# EAGLE design FTDIBreakoutAdapter (EAGLE 7.7.0)
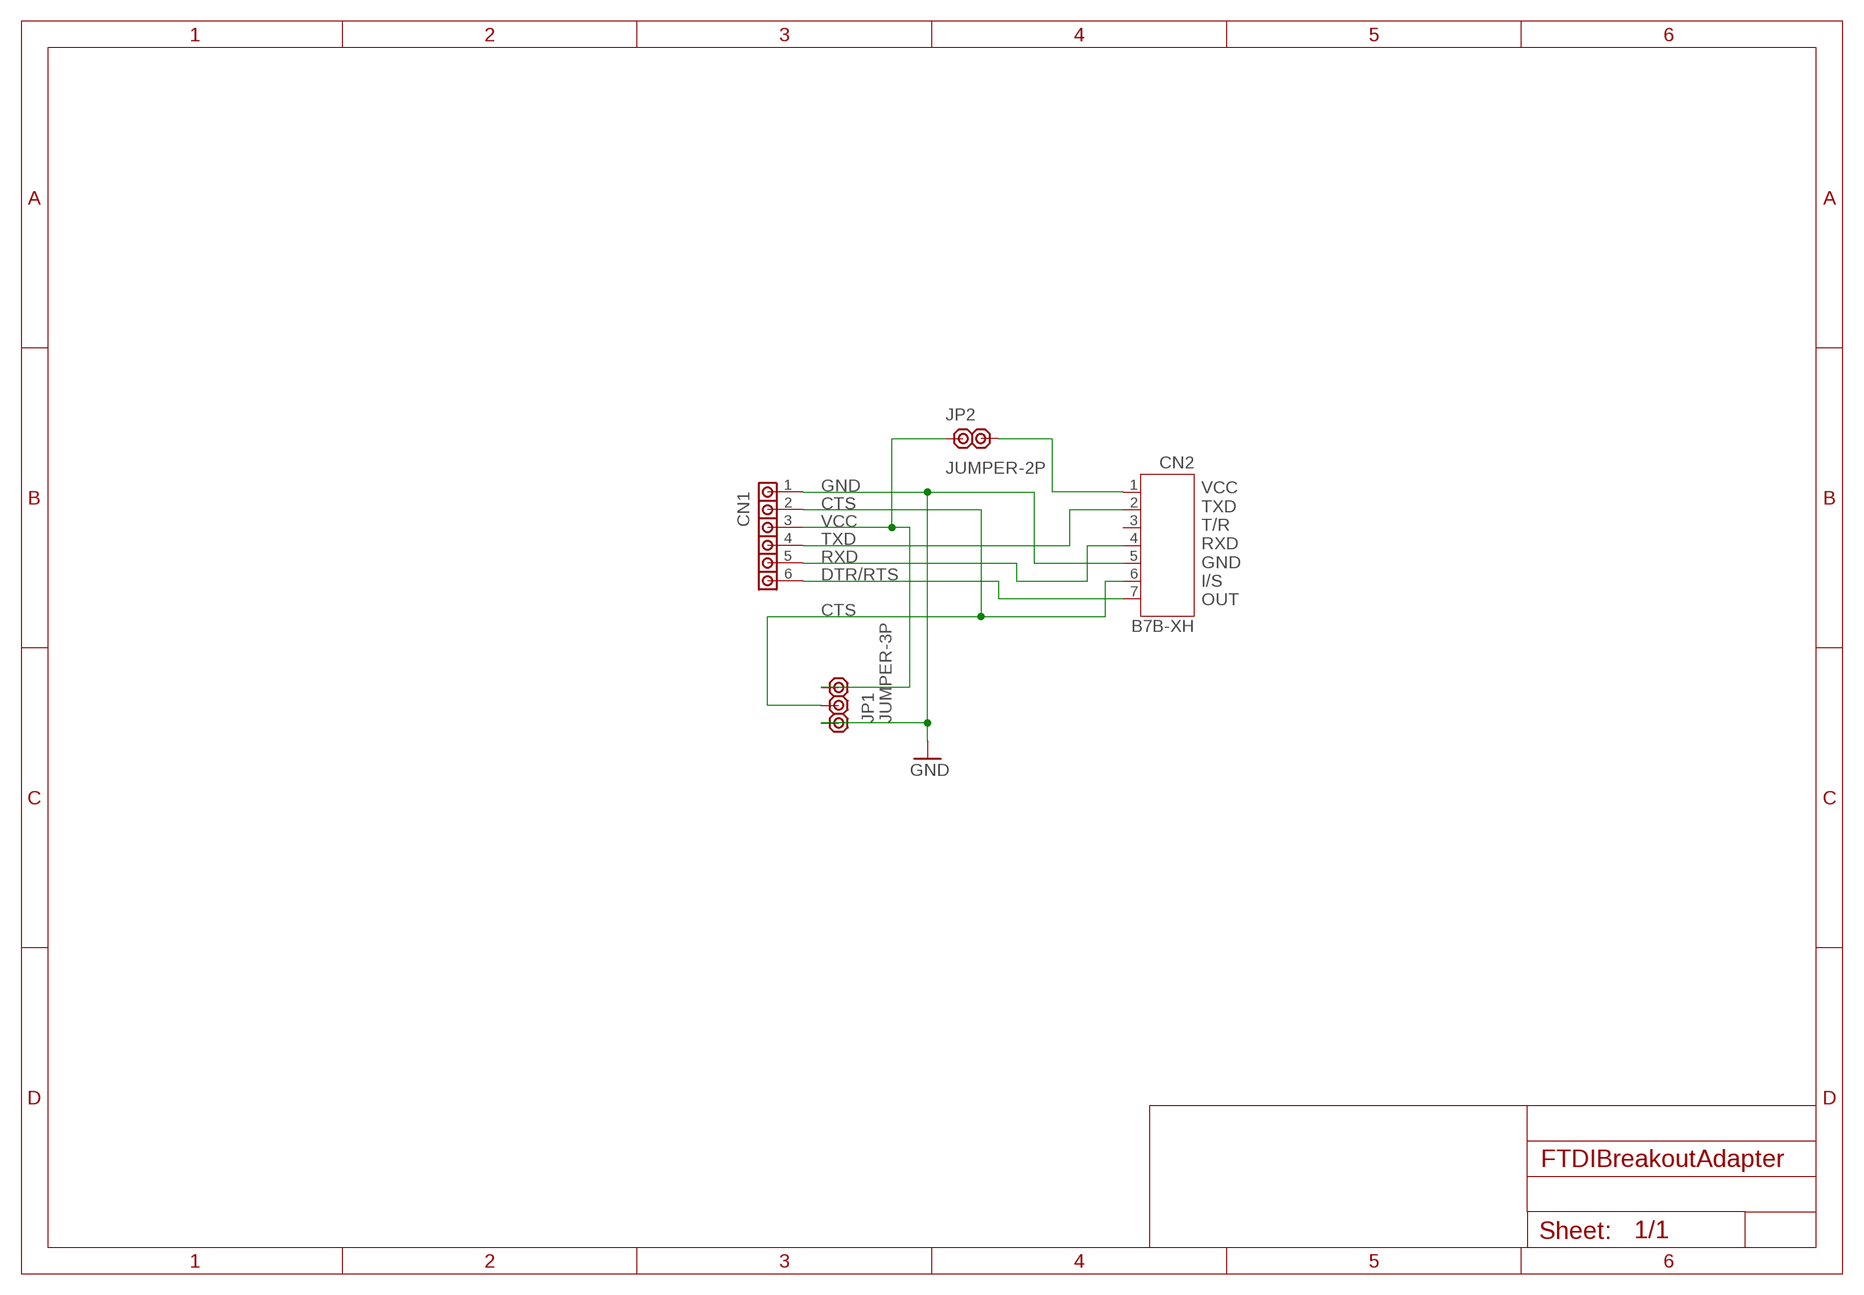
[diagram p0: schematic, sheet 1]

## Parts
CN1  H6-2.54-90D-MALE  [H6-2.54-90D-MALE]
CN2  B7B-XH  [B7B-XH]
JP1  JUMPER-3P  [JUMPER-3P]
JP2  JUMPER-2P  [JUMPER-2P]

## Nets
CTS: CN1.2 CN2.6 JP1.2
DTR/RTS: CN1.6 CN2.7
GND: CN1.1 CN2.5 JP1.3
N$1: CN2.1 JP2.2
RXD: CN1.5 CN2.4
TXD: CN1.4 CN2.2
VCC: CN1.3 JP1.1 JP2.1
Unconnected: CN2.3

## Notes on the sheet
- VCC
  TXD
  T/R
  RXD
  GND
  I/S
  OUT

## Library data of the parts
CN1 = misc:H6-2.54-90D-MALE
CN2 = jst:B7B-XH
JP1 = misc:JUMPER-3P
JP2 = misc:JUMPER-2P

## Board
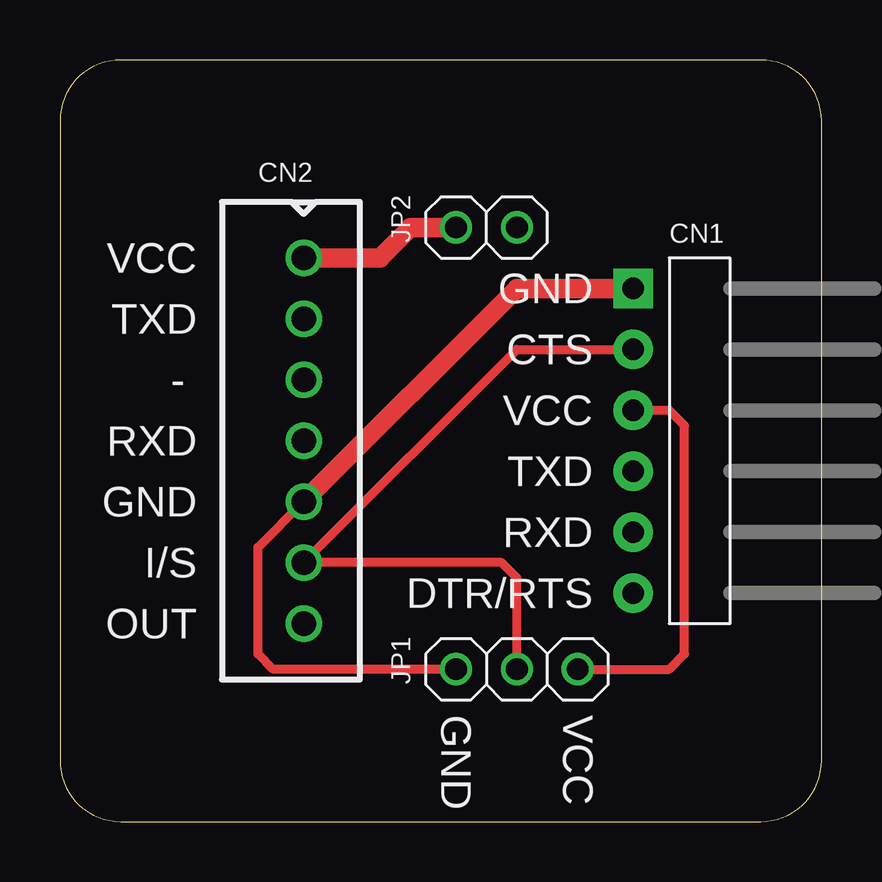
[diagram p1: board, top side]
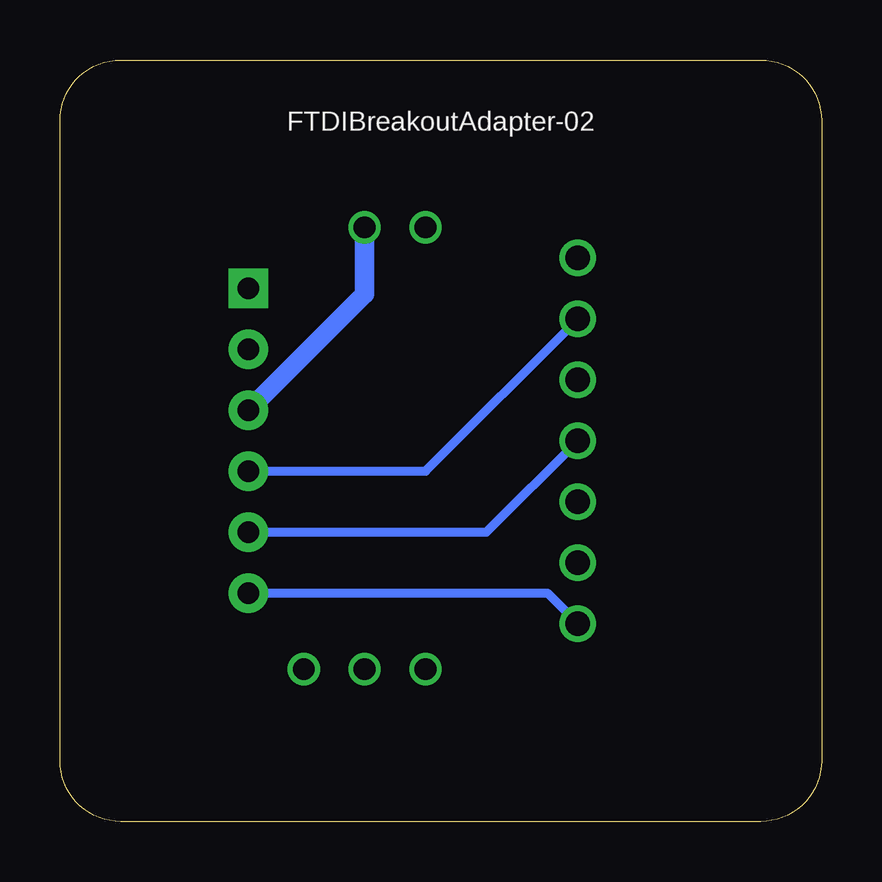
[diagram p2: board, bottom side, seen from below]

Size 31.75 x 31.75 mm. Coordinates in mm from the lower left corner, seen from the top.
Outline: 29.21,31.75 2.54,31.75 arc90 0,29.21 0,2.54 arc90 2.54,0 29.21,0 arc90 31.75,2.54 31.75,29.21 arc90 29.21,31.75
Copper layers (1*16): Top 0.035mm / dielectric 1.6mm / Bottom 0.035mm
Design rules "Elecrow_2-layer_PCB_eagle_rule": minimum track width 6mil, minimum drill 12mil, track to track 6mil, track to pad 6mil, pad to pad 6mil, via to via 8mil, smd to smd 0mil, copper to edge 20mil, drill to drill 10mil, minimum pad ring 6mil, minimum via ring 6mil, stop-mask expansion 0mil, vias tented up to drill 100mil, thermal gap 10mil

### Footprints (pad centres in the part's own frame; a part is rotated, then mirrored left to right if it is on the bottom)
H6-2.54-90D-MALE = drill 0.889 pad 1.651 square: 1 -1.5,6.35 | drill 0.889 pad 1.651: 2 -1.5,3.81; 3 -1.5,1.27; 4 -1.5,-1.27; 5 -1.5,-3.81; 6 -1.5,-6.35
B7B-XH = drill 1.016: 1 7.62,0; 2 5.08,0; 3 2.54,0; 4 0,0; 5 -2.54,0; 6 -5.08,0; 7 -7.62,0
JUMPER-3P = drill 0.9: 1 0,1.27; 2 0,-1.27; 3 0,-3.81
JUMPER-2P = drill 0.9: 1 0,1.27; 2 0,-1.27

### Placement (x,y rotation side)
CN1  25.4,15.88 0 top
CN2  10.16,15.88 90 top
JP1  20.32,6.35 270 top
JP2  17.78,24.77 270 top

### Tracks (layer width: path | path; a pad name or v marks a point on that pad's centre or on a via)
CTS
  Top 0.381: CN1.2 19.05,19.68 CN2.6 18.41,10.79 19.05,10.16 JP1.2
DTR/RTS
  Bottom 0.381: CN1.6 11.43,9.53 CN2.7
GND
  Top 0.381: JP1.3 8.89,6.35 8.26,6.99 8.26,11.43 CN2.5
  Top 0.813: CN1.1 19.05,22.23 CN2.5
N$1
  Top 0.813: JP2.2 14.61,24.77 13.34,23.5 CN2.1
RXD
  Bottom 0.381: CN1.5 13.97,12.06 CN2.4
TXD
  Bottom 0.381: CN1.4 16.51,14.61 CN2.2
VCC
  Top 0.381: CN1.3 25.4,17.14 26.04,16.51 26.04,6.99 25.4,6.35 JP1.1
  Bottom 0.813: JP2.1 19.05,22 CN1.3

### Text on the board
bPlace: FTDIBreakoutAdapter-02
tNames: VCC | GND | TXD | CTS | - | VCC | RXD | TXD | GND | RXD | I/S | DTR/RTS | OUT | GND | VCC